# EAGLE schematic main (EAGLE 6.5.0)
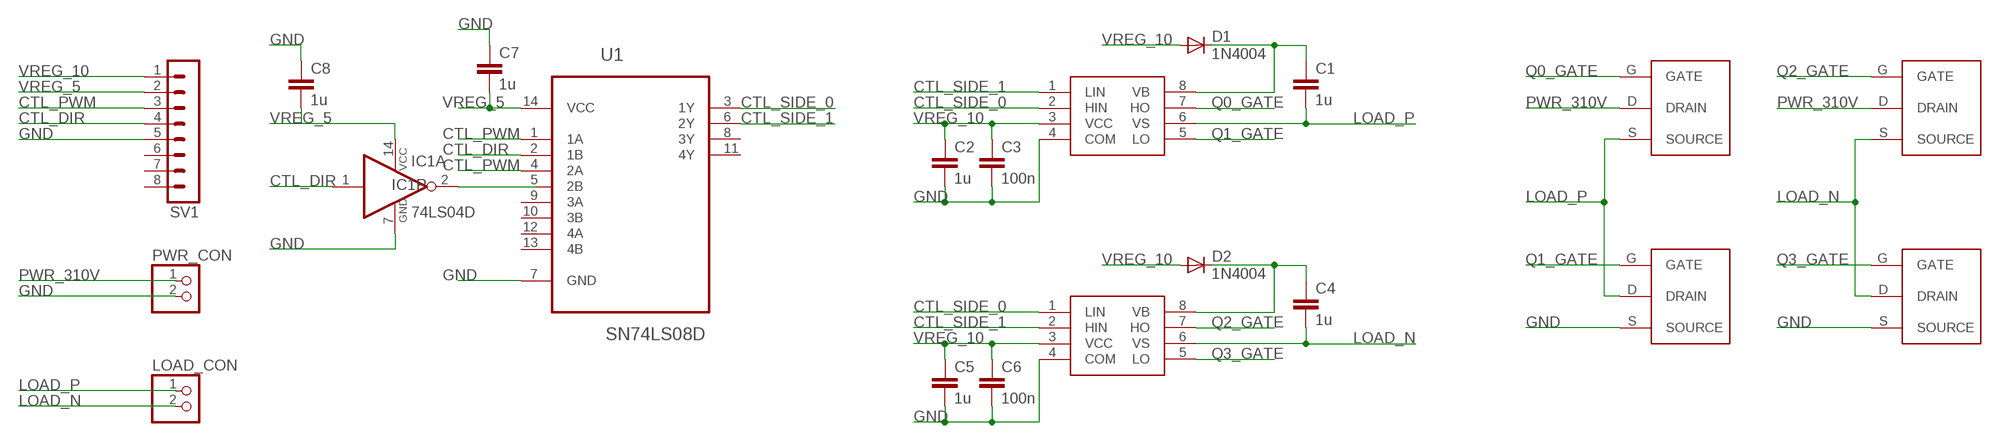
[diagram p0: schematic, sheet 1]

## Parts
C1  1u  C-EUC1206  [C1206]
C2  1u  C-EUC1206  [C1206]
C3  100n  C-EUC1206  [C1206]
C4  1u  C-EUC1206  [C1206]
C5  1u  C-EUC1206  [C1206]
C6  100n  C-EUC1206  [C1206]
C7  1u  C-EUC1206  [C1206]
C8  1u  C-EUC1206  [C1206]
D1  1N4004  [DO41-10]
D2  1N4004  [DO41-10]
IC1  74LS04D  [SO14]
IR2304_0  IR2304  [SOIC8]
IR2304_1  IR2304  [SOIC8]
LOAD_CON  PINHD-1X2  [1X02]
PWR_CON  PINHD-1X2  [1X02]
Q1  IRFP460A  [TO247BV]
Q2  IRFP460A  [TO247BV]
Q3  IRFP460A  [TO247BV]
Q4  IRFP460A  [TO247BV]
SV1  MA08-1  [MA08-1]
U1  SN74LS08D  [SOIC127P600X175-14N]

## Nets
CTL_DIR: IC1.1(A:I) SV1.4 U1.2(1B)
CTL_PWM: SV1.3 U1.1(1A) U1.4(2A)
CTL_SIDE_0: IR2304_0.2(HIN) IR2304_1.1(LIN) U1.3(1Y)
CTL_SIDE_1: IR2304_0.1(LIN) IR2304_1.2(HIN) U1.6(2Y)
GND: C2.2 C3.2 C5.2 C6.2 C7.1 C8.1 IC1.7(P:GND) IR2304_0.4(COM) IR2304_1.4(COM) PWR_CON.2 Q3.S(SOURCE) Q4.S(SOURCE) SV1.5 U1.7(GND)
LOAD_N: C4.2 IR2304_1.6(VS) LOAD_CON.2 Q2.S(SOURCE) Q4.D(DRAIN)
LOAD_P: C1.2 IR2304_0.6(VS) LOAD_CON.1 Q1.S(SOURCE) Q3.D(DRAIN)
N$1: C1.1 D1.C IR2304_0.8(VB)
N$2: C4.1 D2.C IR2304_1.8(VB)
N$5: IC1.2(A:O)
PWR_310V: PWR_CON.1 Q1.D(DRAIN) Q2.D(DRAIN)
Q0_GATE: IR2304_0.7(HO) Q1.G(GATE)
Q1_GATE: IR2304_0.5(LO) Q3.G(GATE)
Q2_GATE: IR2304_1.7(HO) Q2.G(GATE)
Q3_GATE: IR2304_1.5(LO) Q4.G(GATE)
VREG_1: C8.2
VREG_5: C7.2 IC1.14(P:VCC) SV1.2 U1.14(VCC)
VREG_10: C2.1 C3.1 C5.1 C6.1 D1.A D2.A IR2304_0.3(VCC) IR2304_1.3(VCC) SV1.1
Unconnected: IC1.3(B:I) IC1.4(B:O) IC1.5(C:I) IC1.6(C:O) IC1.8(D:O) IC1.9(D:I) IC1.10(E:O) IC1.11(E:I) IC1.12(F:O) IC1.13(F:I) SV1.6 SV1.7 SV1.8 U1.5(2B) U1.8(3Y) U1.9(3A) U1.10(3B) U1.11(4Y) U1.12(4A) U1.13(4B)

## Library data of the parts
C1-C8 = rcl:C-EU: CAPACITOR, European symbol
D1 D2 = diode:1N4004: DIODE general purpose rectifier, 1 A
IC1 = 74xx-eu:74*04: Hex INVERTER
IR2304_0 IR2304_1 = ir2304:IR2304
LOAD_CON PWR_CON = pinhead:PINHD-1X2: PIN HEADER
Q1-Q4 = irfp460a:IRFP460A
SV1 = con-lstb:MA08-1: PIN HEADER; OC_FARNELL: unknown; OC_NEWARK: unknown
U1 = sn74ls08d:SN74LS08D: QUADRUPLE 2-INPUT POSITIVE -AND GATES; MPN: SN74LS08D; OC_FARNELL: 1287549; OC_NEWARK: 08F6633; PACKAGE: SOIC-14; SUPPLIER: Texas Instruments